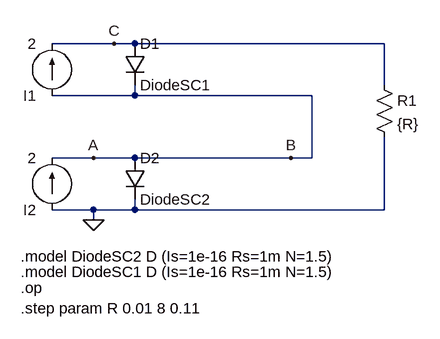
[diagram p0: schematic 6.asc]
6.asc, the LTspice schematic file:
Version 4
SHEET 1 880 680
WIRE 96 128 0 128
WIRE 128 128 96 128
WIRE 512 128 128 128
WIRE 512 192 512 128
WIRE 128 208 128 192
WIRE 128 208 0 208
WIRE 400 208 128 208
WIRE 64 304 0 304
WIRE 128 304 64 304
WIRE 368 304 128 304
WIRE 400 304 400 208
WIRE 400 304 368 304
WIRE 64 384 0 384
WIRE 128 384 128 368
WIRE 128 384 64 384
WIRE 512 384 512 272
WIRE 512 384 128 384
WIRE 64 400 64 384
FLAG 64 400 0
FLAG 64 304 A
FLAG 368 304 B
FLAG 96 128 C
SYMBOL diode 112 128 R0
SYMATTR InstName D1
SYMATTR Value DiodeSC1
SYMBOL current 0 208 R180
WINDOW 123 0 0 Left 0
WINDOW 39 0 0 Left 0
SYMATTR InstName I1
SYMATTR Value 2
SYMBOL diode 112 304 R0
SYMATTR InstName D2
SYMATTR Value DiodeSC2
SYMBOL current 0 384 R180
WINDOW 123 0 0 Left 0
WINDOW 39 0 0 Left 0
SYMATTR InstName I2
SYMATTR Value 2
SYMBOL res 496 176 R0
SYMATTR InstName R1
SYMATTR Value {R}
TEXT -48 456 Left 2 !.model DiodeSC2 D (Is=1e-16 Rs=1m N=1.5)
TEXT -48 480 Left 2 !.model DiodeSC1 D (Is=1e-16 Rs=1m N=1.5)
TEXT -48 504 Left 2 !.op
TEXT -48 536 Left 2 !.step param R 0.01 8 0.11

The netlist it stands for:
* 6.asc
D1 C B DiodeSC1
I1 B C 2
D2 B 0 DiodeSC2
I2 0 B 2
R1 C 0 {R}
.model D D
.lib standard.dio
.model DiodeSC2 D (Is=1e-16 Rs=1m N=1.5)
.model DiodeSC1 D (Is=1e-16 Rs=1m N=1.5)
.op
.step param R 0.01 8 0.11
.backanno
.end